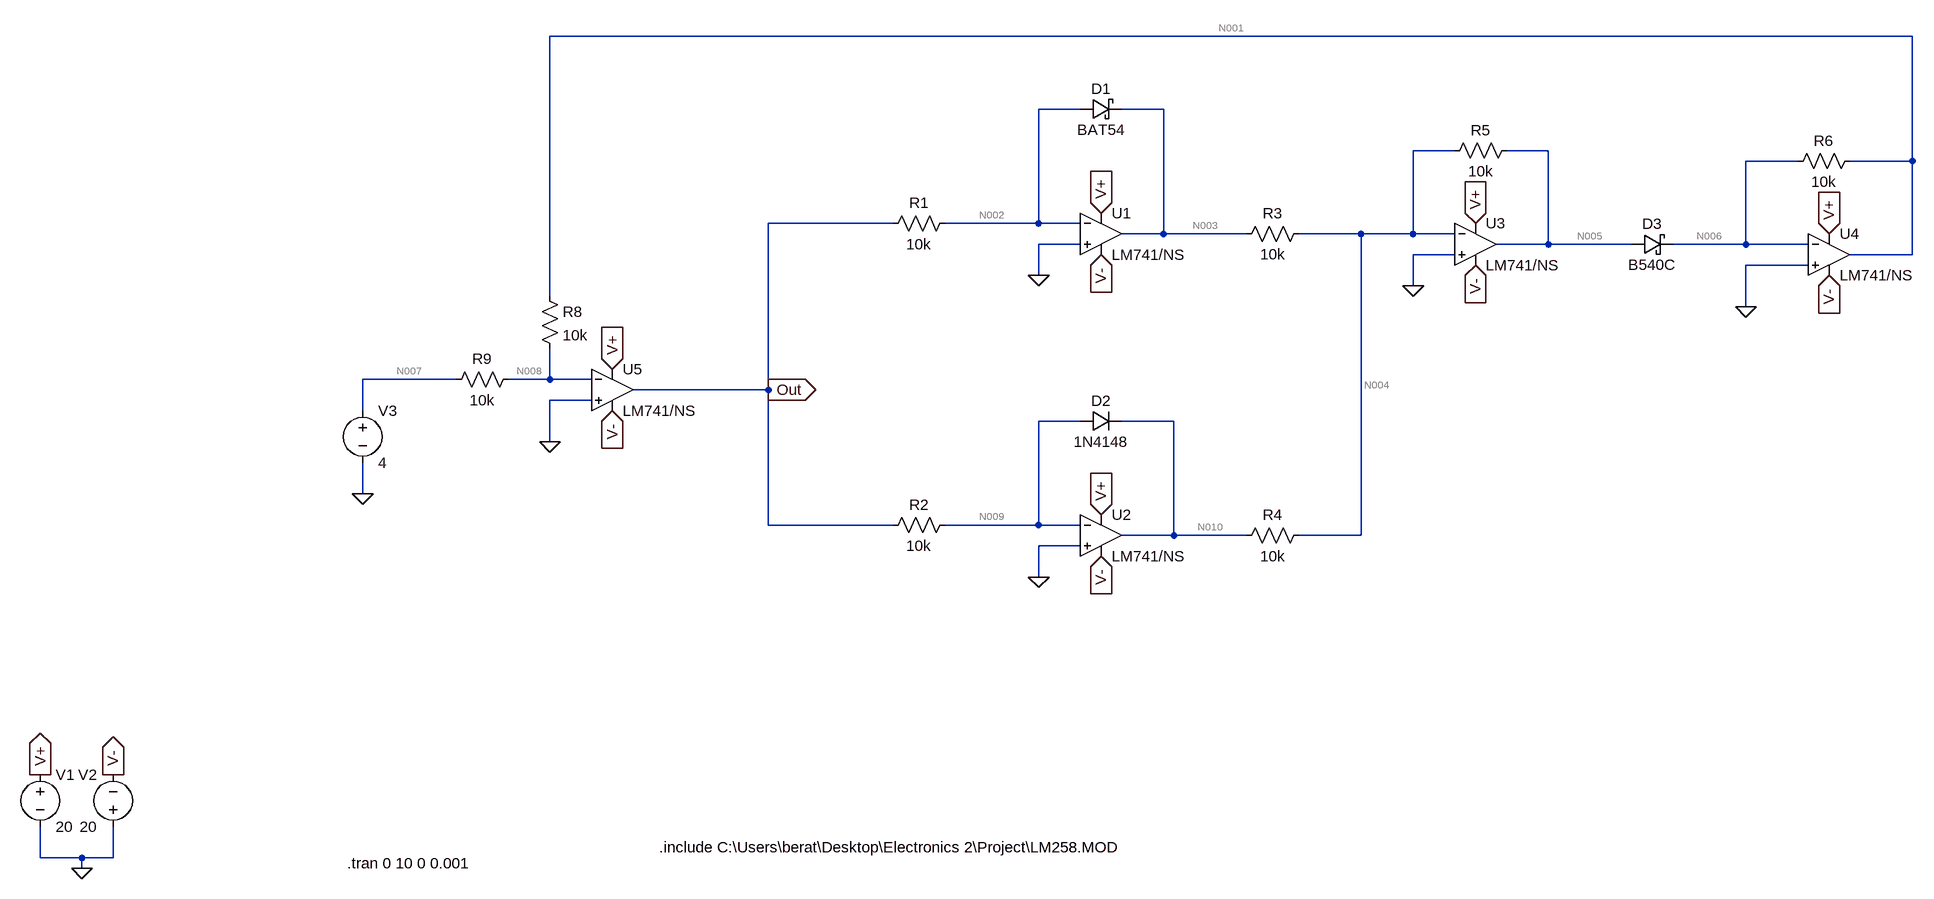
[diagram p0: schematic Draft1.asc]
Draft1.asc, the LTspice schematic file:
Version 4
SHEET 1 1716 680
WIRE 1616 -640 -480 -640
WIRE 336 -528 272 -528
WIRE 464 -528 400 -528
WIRE 912 -464 848 -464
WIRE 1056 -464 992 -464
WIRE 1440 -448 1360 -448
WIRE 1616 -448 1616 -640
WIRE 1616 -448 1520 -448
WIRE 48 -352 -144 -352
WIRE 272 -352 272 -528
WIRE 272 -352 128 -352
WIRE 336 -352 272 -352
WIRE 464 -336 464 -528
WIRE 464 -336 400 -336
WIRE 592 -336 464 -336
WIRE 768 -336 672 -336
WIRE 848 -336 848 -464
WIRE 848 -336 768 -336
WIRE 912 -336 848 -336
WIRE 336 -320 272 -320
WIRE 1056 -320 1056 -464
WIRE 1056 -320 976 -320
WIRE 1184 -320 1056 -320
WIRE 1360 -320 1360 -448
WIRE 1360 -320 1248 -320
WIRE 1456 -320 1360 -320
WIRE 912 -304 848 -304
WIRE 1616 -304 1616 -448
WIRE 1616 -304 1520 -304
WIRE 1456 -288 1360 -288
WIRE 272 -272 272 -320
WIRE 848 -256 848 -304
WIRE -480 -240 -480 -640
WIRE 1360 -224 1360 -288
WIRE -624 -112 -768 -112
WIRE -480 -112 -480 -160
WIRE -480 -112 -544 -112
WIRE -416 -112 -480 -112
WIRE -144 -96 -144 -352
WIRE -144 -96 -352 -96
WIRE -416 -80 -480 -80
WIRE -768 -64 -768 -112
WIRE 336 -48 272 -48
WIRE 480 -48 400 -48
WIRE -480 -16 -480 -80
WIRE -768 64 -768 16
WIRE -144 112 -144 -96
WIRE 48 112 -144 112
WIRE 272 112 272 -48
WIRE 272 112 128 112
WIRE 336 112 272 112
WIRE 480 128 480 -48
WIRE 480 128 400 128
WIRE 592 128 480 128
WIRE 768 128 768 -336
WIRE 768 128 672 128
WIRE 336 144 272 144
WIRE 272 192 272 144
WIRE -1264 624 -1264 576
WIRE -1200 624 -1264 624
WIRE -1152 624 -1152 576
WIRE -1152 624 -1200 624
WIRE -1200 640 -1200 624
FLAG -1200 640 0
FLAG -1264 496 V+
IOPIN -1264 496 Out
FLAG -1152 496 V-
IOPIN -1152 496 Out
FLAG 368 -368 V+
IOPIN 368 -368 In
FLAG 368 -304 V-
IOPIN 368 -304 In
FLAG 368 96 V+
IOPIN 368 96 In
FLAG 368 160 V-
IOPIN 368 160 In
FLAG 944 -352 V+
IOPIN 944 -352 In
FLAG 1488 -336 V+
IOPIN 1488 -336 In
FLAG 944 -288 V-
IOPIN 944 -288 In
FLAG 1488 -272 V-
IOPIN 1488 -272 In
FLAG 272 -272 0
FLAG 272 192 0
FLAG 1360 -224 0
FLAG 848 -256 0
FLAG -384 -128 V+
IOPIN -384 -128 In
FLAG -384 -64 V-
IOPIN -384 -64 In
FLAG -768 64 0
FLAG -144 -96 Out
IOPIN -144 -96 Out
FLAG -480 -16 0
SYMBOL OpAmps\\opamp2 368 -400 R0
SYMATTR InstName U1
SYMATTR Value LM741/NS
SYMBOL voltage -1264 480 R0
WINDOW 123 0 0 Left 0
WINDOW 39 0 0 Left 0
SYMATTR InstName V1
SYMATTR Value 20
SYMBOL voltage -1152 592 R180
WINDOW 0 24 96 Left 2
WINDOW 3 24 16 Left 2
WINDOW 123 0 0 Left 0
WINDOW 39 0 0 Left 0
SYMATTR InstName V2
SYMATTR Value 20
SYMBOL res 144 -368 R90
WINDOW 0 0 56 VBottom 2
WINDOW 3 32 56 VTop 2
SYMATTR InstName R1
SYMATTR Value 10k
SYMBOL schottky 336 -512 R270
WINDOW 0 32 32 VTop 2
WINDOW 3 0 32 VBottom 2
SYMATTR InstName D1
SYMATTR Value BAT54
SYMATTR Description Diode
SYMATTR Type diode
SYMBOL diode 336 -32 R270
WINDOW 0 32 32 VTop 2
WINDOW 3 0 32 VBottom 2
SYMATTR InstName D2
SYMATTR Value 1N4148
SYMBOL OpAmps\\opamp2 368 64 R0
SYMATTR InstName U2
SYMATTR Value LM741/NS
SYMBOL res 144 96 R90
WINDOW 0 0 56 VBottom 2
WINDOW 3 32 56 VTop 2
SYMATTR InstName R2
SYMATTR Value 10k
SYMBOL res 688 -352 R90
WINDOW 0 0 56 VBottom 2
WINDOW 3 32 56 VTop 2
SYMATTR InstName R3
SYMATTR Value 10k
SYMBOL res 688 112 R90
WINDOW 0 0 56 VBottom 2
WINDOW 3 32 56 VTop 2
SYMATTR InstName R4
SYMATTR Value 10k
SYMBOL OpAmps\\opamp2 944 -384 R0
SYMATTR InstName U3
SYMATTR Value LM741/NS
SYMBOL res 1008 -480 R90
WINDOW 0 0 56 VBottom 2
WINDOW 3 32 56 VTop 2
SYMATTR InstName R5
SYMATTR Value 10k
SYMBOL schottky 1184 -304 R270
WINDOW 0 32 32 VTop 2
WINDOW 3 0 32 VBottom 2
SYMATTR InstName D3
SYMATTR Value B540C
SYMATTR Description Diode
SYMATTR Type diode
SYMBOL OpAmps\\opamp2 1488 -368 R0
SYMATTR InstName U4
SYMATTR Value LM741/NS
SYMBOL res 1536 -464 R90
WINDOW 0 0 56 VBottom 2
WINDOW 3 32 56 VTop 2
SYMATTR InstName R6
SYMATTR Value 10k
SYMBOL OpAmps\\opamp2 -384 -160 R0
SYMATTR InstName U5
SYMATTR Value LM741/NS
SYMBOL res -496 -256 R0
SYMATTR InstName R8
SYMATTR Value 10k
SYMBOL res -528 -128 R90
WINDOW 0 0 56 VBottom 2
WINDOW 3 32 56 VTop 2
SYMATTR InstName R9
SYMATTR Value 10k
SYMBOL voltage -768 -80 R0
WINDOW 123 0 0 Left 0
WINDOW 39 0 0 Left 0
SYMATTR InstName V3
SYMATTR Value 4
TEXT -312 608 Left 2 !.include C:\\Users\\berat\\Desktop\\Electronics 2\\Project\\LM258.MOD
TEXT -792 632 Left 2 !.tran 0 10 0 0.001

The netlist it stands for:
* Draft1.asc
XU1 0 N002 V+ V- N003 LM741/NS  ; pins In+ In- V+ V- OUT
V1 V+ 0 20
V2 0 V- 20
R1 N002 Out 10k
D1 N002 N003 BAT54
D2 N009 N010 1N4148
XU2 0 N009 V+ V- N010 LM741/NS  ; pins In+ In- V+ V- OUT
R2 N009 Out 10k
R3 N004 N003 10k
R4 N004 N010 10k
XU3 0 N004 V+ V- N005 LM741/NS  ; pins In+ In- V+ V- OUT
R5 N005 N004 10k
D3 N005 N006 B540C
XU4 0 N006 V+ V- N001 LM741/NS  ; pins In+ In- V+ V- OUT
R6 N001 N006 10k
XU5 0 N008 V+ V- Out LM741/NS  ; pins In+ In- V+ V- OUT
R8 N001 N008 10k
R9 N008 N007 10k
V3 N007 0 4
.model D D
.lib standard.dio
.include C:\Users\berat\Desktop\Electronics 2\Project\LM258.MOD
.tran 0 10 0 0.001
.backanno
.end

* Results of the author's LTspice run, read from the files saved beside the schematic
* Operating Point, zero values left out:
*   V(n002) = -6.48 V
*   V(v-) = -20 V
*   V(v+) = 20 V
*   V(n003) = 18.88 V
*   V(out) = -18.88 V
*   V(n009) = -6.48 V
*   V(n010) = 18.88 V
*   V(n004) = 6.262 V
*   V(n005) = -18.84 V
*   V(n006) = 944.9 µV
*   V(n001) = 10.91 V
*   V(n008) = 7.381 V
*   V(n007) = 4 V
*   I(D3) = -1.091 mA
*   I(D2) = -1.227 mA
*   I(D1) = -1.227 mA
*   I(R9) = 338.1 µA
*   I(R8) = 353 µA
*   I(R6) = 1.091 mA
*   I(R5) = -2.51 mA
*   I(R4) = -1.261 mA
*   I(R3) = -1.261 mA
*   I(R2) = 1.24 mA
*   I(R1) = 1.24 mA
*   I(V3) = 338.1 µA
*   I(V2) = -14.62 mA
*   I(V1) = -14.96 mA